# EAGLE board Tracker_v5 (EAGLE 9.6.2)
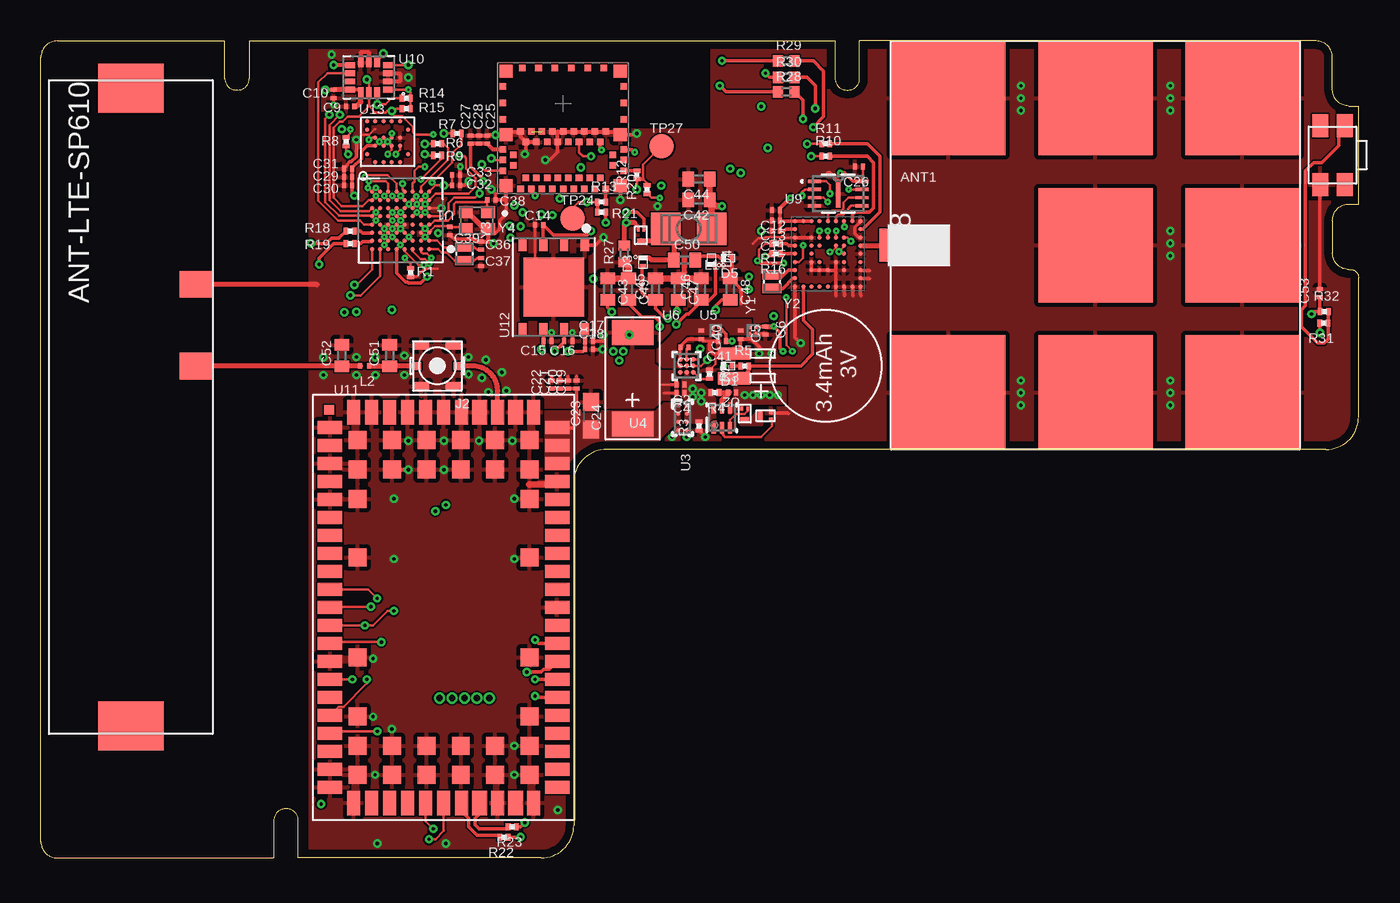
[diagram p8: board, top side]
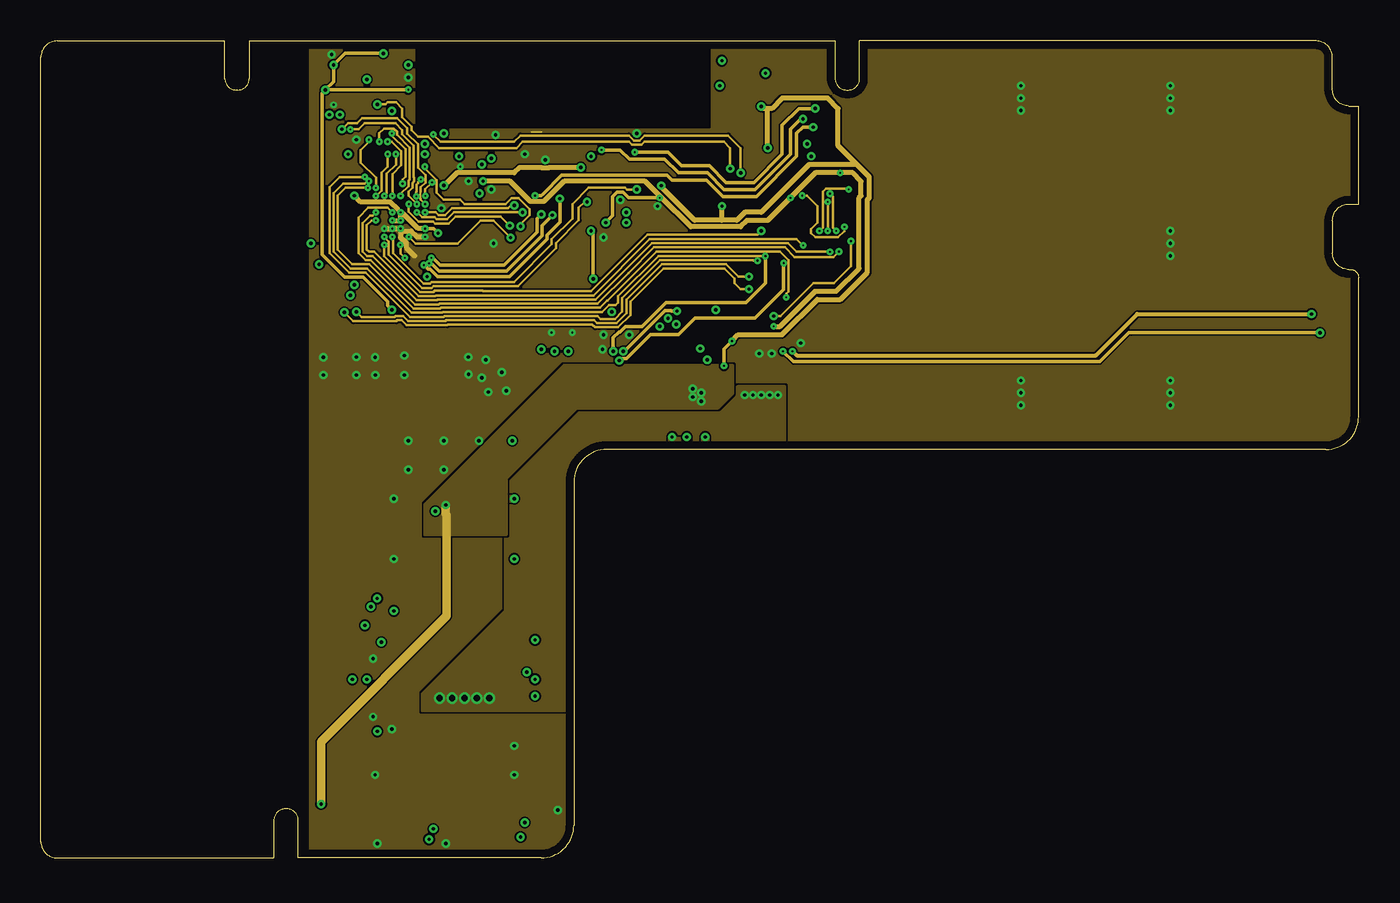
[diagram p9: board, inner layer Route2]
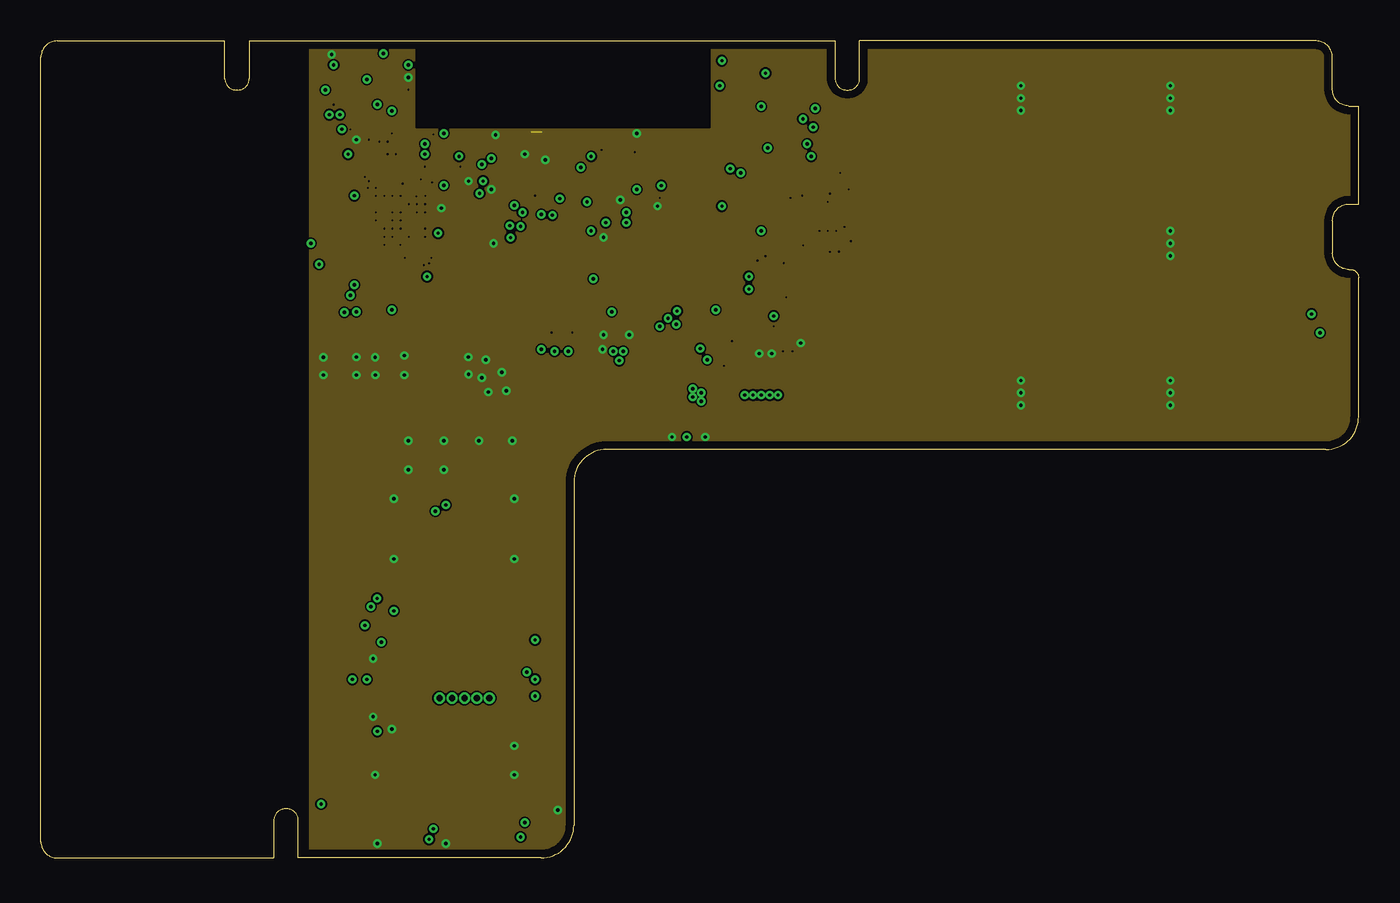
[diagram p10: board, inner layer Route15]
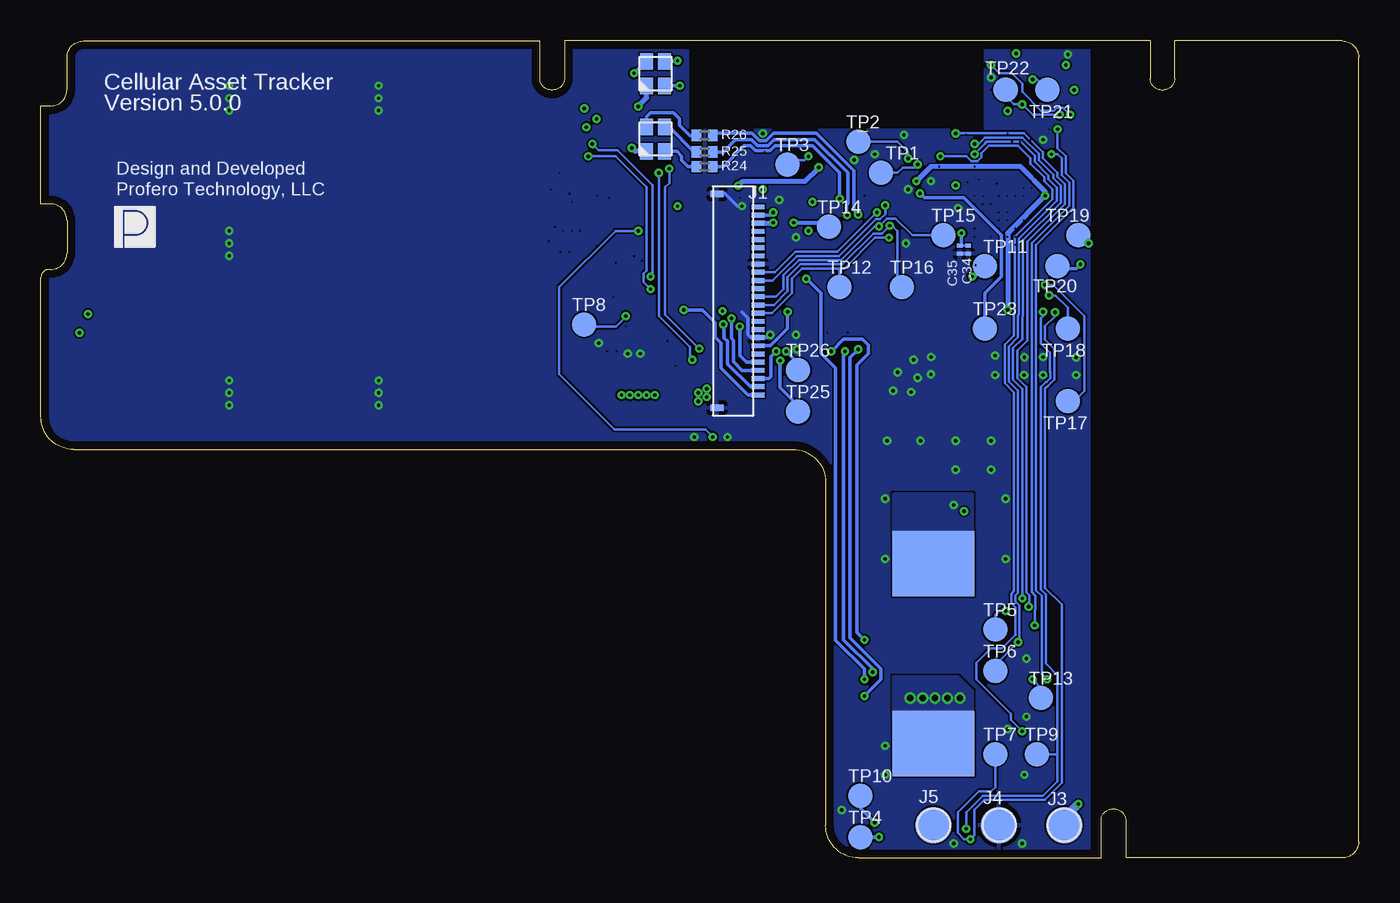
[diagram p11: board, bottom side, seen from below]

Size 80.6 x 49.98 mm. Coordinates in mm from the lower left corner, seen from the top.
Outline: 78.6,24.99 arc90 80.6,26.99 80.6,35.5 arc90 80.1,36 80,36 arc-90 79,37 79,39 arc-90 80,40 80.6,40 80.6,46 80,46 arc-90 79,47 79,48.98 arc90 78,49.98 50.08,49.98 50.08,47.68 arc-90 49.38,46.98 49.28,46.98 arc-90 48.58,47.68 48.58,49.98 12.75,49.98 12.75,47.68 arc-90 12.05,46.98 11.95,46.98 arc-90 11.25,47.68 11.25,49.98 1,49.98 arc90 0,48.98 0,1 arc90 1,0 14.25,0 14.25,2.3 arc-90 14.95,3 15.05,3 arc-90 15.75,2.3 15.75,0 30.6,0 arc90 32.6,2 32.6,22.99 arc-90 34.6,24.99 78.6,24.99
Copper layers ([2:1+2*15+16:15]): Top 0.035mm / dielectric 0.2mm / Route2 0.035mm / dielectric 0.26mm / Route15 0.035mm / dielectric 0.2mm / Bottom 0.035mm
Design rules "default *": minimum track width 3mil, minimum drill 8mil, track to track 4mil, track to pad 4mil, pad to pad 4mil, via to via 4mil, smd to smd 4mil, copper to edge 20mil, drill to drill 6mil, minimum pad ring 10mil, minimum via ring 6mil, stop-mask expansion 4mil, vias tented up to drill 16mil, thermal gap 10mil
Net classes: 1 diff: width 0.203 mm, clearance 0.127 mm
tKeepout: area 78.3,22 to 80.2,23.9; area 78.1,51.4 to 79.9,53.3

## Footprints (pad centres in the part's own frame; a part is rotated, then mirrored left to right if it is on the bottom)
SGGP.25.2.A.02 = smd 7 x 7: 1 -9,9; 2 0,9; 3 9,9; 4 -9,0; 5 0,0; 6 9,0; 7 -9,-9; 9 9,-9 | smd 2 x 2.5: 8 0,-11.95
C0201 = smd 0.25 x 0.35: 1 -0.25,0; 2 0.25,0
C0603 = smd 1.1 x 1: 1 -0.85,0; 2 0.85,0
AVX-C = smd 1.524 x 2.54: + -2.794,0; - 2.794,0
C0402 = smd 0.7 x 0.9: 1 -0.65,0; 2 0.65,0
BAT30F4 = smd 0.25 x 0.35: 1 -0.25,0; 2 0.25,0
CLMVC-FKA = smd 1 x 0.8: B1 -0.75,0.55; B2 0.75,0.55; B3 0.75,-0.55; B4 -0.75,-0.55
FH19C-24S-0.5SH = smd 0.4 x 0.8: 1 -6.55,-1.25; 2 6.55,-1.25 | smd 0.3 x 0.8: P1 -5.75,1.25; P2 -5.25,1.25; P3 -4.75,1.25; P4 -4.25,1.25; P5 -3.75,1.25; P6 -3.25,1.25; P7 -2.75,1.25; P8 -2.25,1.25; P9 -1.75,1.25; P10 -1.25,1.25; P11 -0.75,1.25; P12 -0.25,1.25; P13 0.25,1.25; P14 0.75,1.25; P15 1.25,1.25; P16 1.75,1.25; P17 2.25,1.25; P18 2.75,1.25; P19 3.25,1.25; P20 3.75,1.25; P21 4.25,1.25; P22 4.75,1.25; P23 5.25,1.25; P24 5.75,1.25
MM8430-2610 = smd 0.5 x 0.5: IN -1.25,0; OUT 1.25,0 | smd 1 x 0.5: P$1 -1,1.25; P$2 1,1.25; P$3 1,-1.25; P$4 -1,-1.25
MILL_MAX_1578 = smd 2.24 x 2.24: P$1 0,0
PAD_4MMX5MM = smd 4 x 5: P$1 0,0
L3225P = smd 1.8 x 2: 1 -1.4,0; 2 1.4,0
L0201 = smd 0.25 x 0.35: 1 -0.275,0; 2 0.275,0
3-XFDFN = smd 0.15 x 0.25: 1 0.175,-0.325; 2 -0.175,-0.325 | smd 0.5 x 0.25: 3 0,0.325
R0201 = smd 0.28 x 0.43: 1 -0.255,0; 2 0.255,0
R0402 = smd 0.6 x 0.7: 1 -0.5,0; 2 0.5,0
EVQ-7PJ/A = smd 1.4 x 1: P$1 -1.8,0.75; P$2 1.8,0.75; P$3 -1.8,-0.75; P$4 1.8,-0.75
TP15R = smd 1.5 x 1.5: TP 0,0
BGA64C50P8X8_500X500X60N = smd 0.28 x 0.28: A1 -1.75,1.75; A2 -1.25,1.75; A3 -0.75,1.75; A4 -0.25,1.75; A5 0.25,1.75; A6 0.75,1.75; A7 1.25,1.75; A8 1.75,1.75; B1 -1.75,1.25; B2 -1.25,1.25; B3 -0.75,1.25; B4 -0.25,1.25; B5 0.25,1.25; B6 0.75,1.25; B7 1.25,1.25; B8 1.75,1.25; C1 -1.75,0.75; C2 -1.25,0.75; C3 -0.75,0.75; C4 -0.25,0.75; C5 0.25,0.75; C6 0.75,0.75; C7 1.25,0.75; C8 1.75,0.75; D1 -1.75,0.25; D2 -1.25,0.25; D3 -0.75,0.25; D4 -0.25,0.25; D5 0.25,0.25; D6 0.75,0.25; D7 1.25,0.25; D8 1.75,0.25; E1 -1.75,-0.25; E2 -1.25,-0.25; E3 -0.75,-0.25; E4 -0.25,-0.25; E5 0.25,-0.25; E6 0.75,-0.25; E7 1.25,-0.25; E8 1.75,-0.25; F1 -1.75,-0.75; F2 -1.25,-0.75; F3 -0.75,-0.75; F4 -0.25,-0.75; F5 0.25,-0.75; F6 0.75,-0.75; F7 1.25,-0.75; F8 1.75,-0.75; G1 -1.75,-1.25; G2 -1.25,-1.25; G3 -0.75,-1.25; G4 -0.25,-1.25; G5 0.25,-1.25; G6 0.75,-1.25; G7 1.25,-1.25; G8 1.75,-1.25; H1 -1.75,-1.75; H2 -1.25,-1.75; H3 -0.75,-1.75; H4 -0.25,-1.75; H5 0.25,-1.75; H6 0.75,-1.75; H7 1.25,-1.75; H8 1.75,-1.75
21-100221A_W91G1+3 = smd 0.305 x 0.305: A1 -0.4,0.4; A2 0,0.4; A3 0.4,0.4; B1 -0.4,0; B2 0,0; B3 0.4,0; C1 -0.4,-0.4; C2 0,-0.4; C3 0.4,-0.4
DSE0006A = smd 0.66 x 0.25: 1 -0.62,0.5 | smd 0.7 x 0.25: 2 -0.6,0; 3 -0.6,-0.5; 4 0.6,-0.5; 5 0.6,0; 6 0.6,0.5
YZP0008ADCD = smd 0.23 x 0.23: A1 -0.25,0.75; A2 0.25,0.75; B1 -0.25,0.25; B2 0.25,0.25; C1 -0.25,-0.25; C2 0.25,-0.25; D1 -0.25,-0.75; D2 0.25,-0.75
WCSP4F = smd 0.203 x 0.203: A1 -0.175,0.175; A2 0.175,0.175; B1 -0.175,-0.175; B2 0.175,-0.175
ISP1507-AL = smd 0.8 x 0.8: 1 0.5,-0.5; 7 0.5,-3.6; 25 7.5,-3.6; 31 7.5,-0.5; 52 0.5,-7.5; 59 7.5,-7.5 | smd 0.4 x 0.4: 2 0.3,-1.4; 3 0.95,-1.725; 4 0.3,-2.05; 5 0.95,-2.375; 6 0.3,-2.7; 8 1.4,-3.8; 9 1.725,-3.15; 10 2.05,-3.8; 11 2.375,-3.15; 12 2.7,-3.8; 13 3.025,-3.15; 14 3.35,-3.8; 15 3.675,-3.15; 16 4,-3.8; 17 4.325,-3.15; 18 4.65,-3.8; 19 4.975,-3.15; 20 5.3,-3.8; 21 5.625,-3.15; 22 5.95,-3.8; 23 6.275,-3.15; 24 6.6,-3.8; 26 7.7,-2.7; 27 7.05,-2.375; 28 7.7,-2.05; 29 7.05,-1.725; 30 7.7,-1.4; 32 6.6,-0.3; 33 6.275,-0.95; 34 5.95,-0.3; 35 5.625,-0.95; 36 5.3,-0.3; 37 4.975,-0.95; 38 4.65,-0.3; 39 4.325,-0.95; 40 4,-0.3; 41 3.675,-0.95; 42 3.35,-0.3; 43 3.025,-0.95; 44 2.7,-0.3; 45 2.375,-0.95; 46 2.05,-0.3; 47 1.725,-0.95; 48 1.4,-0.3; 49 0.3,-4.55; 50 0.3,-5.55; 51 0.3,-6.55; 53 1.5,-7.7; 54 2.5,-7.7; 55 3.5,-7.7; 56 4.5,-7.7; 57 5.5,-7.7; 58 6.5,-7.7; 60 7.7,-6.55; 61 7.7,-5.55; 62 7.7,-4.55
ZOE-M8 = smd 0.27 x 0.27: P$2E1 -2,0; P$A1 -2,2; P$A2 -1.5,2; P$A3 -1,2; P$A4 -0.5,2; P$A5 0,2; P$A6 0.5,2; P$A7 1,2; P$A8 1.5,2; P$A9 2,2; P$B1 -2,1.5; P$B9 2,1.5; P$C1 -2,1; P$C3 -1,1; P$C4 -0.5,1; P$C5 0,1; P$C6 0.5,1; P$C7 1,1; P$C9 2,1; P$D1 -2,0.5; P$D3 -1,0.5; P$D4 -0.5,0.5; P$D6 0.5,0.5; P$D9 2,0.5; P$E3 -1,0; P$E7 1,0; P$E9 2,0; P$F1 -2,-0.5; P$F3 -1,-0.5; P$F4 -0.5,-0.5; P$F6 0.5,-0.5; P$F7 1,-0.5; P$F9 2,-0.5; P$G1 -2,-1; P$G3 -1,-1; P$G4 -0.5,-1; P$G5 0,-1; P$G6 0.5,-1; P$G7 1,-1; P$G9 2,-1; P$H1 -2,-1.5; P$H9 2,-1.5; P$J1 -2,-2; P$J2 -1.5,-2; P$J3 -1,-2; P$J4 -0.5,-2; P$J5 0,-2; P$J6 0.5,-2; P$J7 1,-2; P$J8 1.5,-2; P$J9 2,-2
USON-8L-2X3X0P6_MAC = smd 0.813 x 0.203: 1 -1.448,0.75; 2 -1.448,0.25; 3 -1.448,-0.25; 4 -1.448,-0.75; 5 1.448,-0.75; 6 1.448,-0.25; 7 1.448,0.25; 8 1.448,0.75 | smd 0.305 x 1.702: 9 0,0
PQFN50P300X250X86-14N = smd 0.6 x 0.35: 1 -1.16,0.75; 2 -1.16,0.25; 3 -1.16,-0.25; 4 -1.16,-0.75; 8 1.16,-0.75; 9 1.16,-0.25; 10 1.16,0.25; 11 1.16,0.75 | smd 0.35 x 0.6: 5 -0.5,-0.91; 6 0,-0.91; 7 0.5,-0.91; 12 0.5,0.91; 13 0,0.91; 14 -0.5,0.91
SARA-R4 = smd 1.5 x 0.8: 1 1.05,-2; 2 1.05,-3.1; 3 1.05,-4.2; 4 1.05,-5.3; 5 1.05,-6.4; 6 1.05,-7.5; 7 1.05,-8.6; 8 1.05,-9.7; 9 1.05,-10.8; 10 1.05,-11.9; 11 1.05,-13; 12 1.05,-14.1; 13 1.05,-15.2; 14 1.05,-16.3; 15 1.05,-17.4; 16 1.05,-18.5; 17 1.05,-19.6; 18 1.05,-20.7; 19 1.05,-21.8; 20 1.05,-22.9; 21 1.05,-24; 33 14.95,-24; 34 14.95,-22.9; 35 14.95,-21.8; 36 14.95,-20.7; 37 14.95,-19.6; 38 14.95,-18.5; 39 14.95,-17.4; 40 14.95,-16.3; 41 14.95,-15.2; 42 14.95,-14.1; 43 14.95,-13; 44 14.95,-11.9; 45 14.95,-10.8; 46 14.95,-9.7; 47 14.95,-8.6; 48 14.95,-7.5; 49 14.95,-6.4; 50 14.95,-5.3; 51 14.95,-4.2; 52 14.95,-3.1; 53 14.95,-2 | smd 0.8 x 1.5: 22 2.5,-24.95; 23 3.6,-24.95; 24 4.7,-24.95; 25 5.8,-24.95; 26 6.9,-24.95; 27 8,-24.95; 28 9.1,-24.95; 30 11.3,-24.95; 32 13.5,-24.95; 54 13.5,-1.05; 56 11.3,-1.05; 58 9.1,-1.05; 59 8,-1.05; 60 6.9,-1.05; 61 5.8,-1.05; 62 4.7,-1.05; 63 3.6,-1.05; 64 2.5,-1.05 | smd 0.9 x 1.5: 29 10.2,-24.95; 31 12.4,-24.95; 55 12.4,-1.05; 57 10.2,-1.05 | smd 1.1 x 1.1: 65 2.75,-2.75; 66 4.85,-2.75; 67 6.95,-2.75; 68 9.05,-2.75; 69 11.15,-2.75; 70 13.25,-2.75; 71 2.75,-4.55; 72 4.85,-4.55; 73 6.95,-4.55; 74 9.05,-4.55; 75 11.15,-4.55; 76 13.25,-4.55; 77 2.75,-6.35; 78 13.25,-6.35; 79 2.75,-9.95; 80 13.25,-9.95; 81 2.75,-16.05; 82 13.25,-16.05; 83 2.75,-19.65; 84 13.25,-19.65; 85 2.75,-21.45; 86 4.85,-21.45; 87 6.95,-21.45; 88 9.05,-21.45; 89 11.15,-21.45; 90 13.25,-21.45; 91 2.75,-23.25; 92 4.85,-23.25; 93 6.95,-23.25; 94 9.05,-23.25; 95 11.15,-23.25; 96 13.25,-23.25 | smd 0.6 x 0.6: P$1 1,-0.9
PSON127P500X600X82-9N = smd 0.71 x 0.51: 1 -2.55,1.905; 2 -2.55,0.635; 3 -2.55,-0.635; 4 -2.55,-1.905; 5 2.55,-1.905; 6 2.55,-0.635; 7 2.55,0.635; 8 2.55,1.905 | smd 3.6 x 3.7: 9 0,0
21-WLCSP = smd 0.275 x 0.275: A2 -0.75,1.25; A5 0.75,1.25; A6 1.25,1.25; B1 -1.25,0.75; B3 -0.25,0.75; B4 0.25,0.75; B6 1.25,0.75; C1 -1.25,0.25; C3 -0.25,0.25; C4 0.25,0.25; C6 1.25,0.25; D1 -1.25,-0.25; D3 -0.25,-0.25; D4 0.25,-0.25; D6 1.25,-0.25; E1 -1.25,-0.75; E3 -0.25,-0.75; E4 0.25,-0.75; E6 1.25,-0.75; F2 -0.75,-1.25; F5 0.75,-1.25
ANT-LTE-SP610-T = smd 1.65 x 2: 1 2.5,-4; 2 7.5,-4 | smd 3 x 4: 3 -19.5,0; 4 19.5,0
ECS-.327-12.5-1210-TR = smd 0.575 x 1.14: 1 -0.412,0; 2 0.412,0
ML614-TZ21 = smd 0.75 x 2: 1 0.75,1; 2 -0.75,1
XTAL_ECS-160-9-37-CKM-TR = smd 0.85 x 0.75: 1 -0.675,-0.525; 2 0.675,-0.525; 3 0.675,0.525; 4 -0.675,0.525

## Placement (x,y rotation side)
ANT1  SGGP.25.2.A.02  [SGGP.25.2.A.02]  64.5,37.48 270 top
C1  0.47uF  [C0201]  39.37,31.24 180 top
C2  0.1uF  [C0201]  39.12,28.96 180 top
C3  0.1uF  [C0201]  42.27,28.47 0 top
C4  1uF  [C0201]  39.12,28.45 180 top
C5  1uF  [C0201]  42.8,32 270 top
C6  1uF  [C0201]  44.32,32.26 270 top
C9  0.1uF  [C0201]  18.92,45.97 180 top
C10  0.1uF  [C0201]  17.91,46.74 270 top
C11  0.1uF  [C0201]  44.96,38.35 180 top
C12  1uF  [C0201]  44.96,39.62 180 top
C13  0.01uF  [C0201]  44.96,38.99 180 top
C14  47pF  [C0201]  30.48,38.73 180 top
C15  47pF  [C0201]  30.99,31.62 0 top
C16  47pF  [C0201]  32.26,31.62 0 top
C17  0.1uF  [C0201]  33.53,31.62 0 top
C18  47pF  [C0201]  33.53,31.11 0 top
C19  15pF  [C0201]  32.77,28.96 90 top
C20  68pF  [C0201]  32.26,28.96 90 top
C21  10000pF  [C0201]  31.75,28.96 90 top
C22  0.1uF  [C0201]  31.24,28.96 90 top
C23  10uF  [C0603]  33.66,27.05 90 top
C24  F931C107MCC  [AVX-C]  36.2,29.34 90 top
C25  0.1uF  [C0201]  27.3,43.94 90 top
C26  0.1uF  [C0201]  50.04,42.29 180 top
C27  0.1uF  [C0201]  26.29,43.94 90 top
C28  1uF  [C0201]  26.8,43.94 90 top
C29  10000pF  [C0201]  18.8,41.66 180 top
C30  10000pF  [C0201]  18.8,41.15 180 top
C31  10000pF  [C0201]  18.8,42.16 180 top
C32  0.1uF  [C0201]  25.4,41.15 0 top
C33  10000pF  [C0201]  25.4,41.78 0 top
C34  0.1uF  [C0201]  23.88,37.21 270 bottom
C35  10000pF  [C0201]  24.38,37.21 270 bottom
C36  [C0201]  26.92,37.47 90 top
C37  [C0201]  26.92,36.45 270 top
C38  [C0201]  27.56,40.26 0 top
C39  [C0201]  25.02,38.35 270 top
C40  1uF  [C0201]  40.39,32 270 top
C41  1uF  [C0201]  41.66,31.62 180 top
C42  1uF  [C0402]  40.26,40.26 180 top
C43  1uF  [C0402]  34.67,34.8 270 top
C44  0.1uF  [C0402]  40.26,41.53 180 top
C45  1uF  [C0402]  37.59,34.8 90 top
C46  1uF  [C0402]  40.39,34.8 90 top
C47  1uF  [C0402]  38.99,34.8 270 top
C48  1uF  [C0402]  42.16,34.8 270 top
C49  1uF  [C0402]  35.94,34.8 270 top
C50  4.7uF  [C0402]  39.37,36.58 0 top
C51  [C0402]  21.34,30.73 90 top
C52  [C0402]  18.41,30.73 90 top
C53  100pF  [C0201]  78.22,34.55 90 top
D1  BAT30F4  [BAT30F4]  42.04,30.1 180 top
D2  CLMVC-FKA  [CLMVC-FKA]  43,43.98 90 bottom
D3  BAT30F4  [BAT30F4]  36.83,36.45 90 top
D4  BAT30F4  [BAT30F4]  41.02,36.58 270 top
D5  BAT30F4  [BAT30F4]  42.04,36.7 180 top
D6  CLMVC-FKA  [CLMVC-FKA]  43,47.98 90 bottom
J1  E2154CS091  [FH19C-24S-0.5SH]  38,34.08 270 bottom
J2  MM8430-2610  [MM8430-2610]  24.26,30.1 180 top
J3  1578-X-57-15-00-00-03-0  [MILL_MAX_1578]  18,2 270 bottom
J4  1578-X-57-15-00-00-03-0  [MILL_MAX_1578]  22,2 270 bottom
J5  1578-X-57-15-00-00-03-0  [MILL_MAX_1578]  26,2 270 bottom
J6  SMD_PADPAD_4MMX5MM  [PAD_4MMX5MM]  26,18 270 bottom
J7  SMD_PADPAD_4MMX5MM  [PAD_4MMX5MM]  26,7 270 bottom
L1  CBC3225T100KR  [L3225P]  39.62,38.48 180 top
L2  [L0201]  19.81,30.1 180 top
Q1  CSD13381F412VN  [3-XFDFN]  43.05,27.18 180 top
Q2  CSD13381F412VN  [3-XFDFN]  44.32,27.05 90 top
Q3  CSD13381F412VN  [3-XFDFN]  36.7,38.1 180 top
R1  100k  [R0201]  22.61,35.81 270 top
R2  10k  [R0201]  40.89,29.59 270 top
R3  2k  [R0201]  40.26,26.42 90 top
R4  330  [R0201]  41.22,28.47 180 top
R5  1k  [R0201]  43.05,30.1 0 top
R6  100  [R0201]  24.26,43.69 180 top
R7  100  [R0201]  25.46,44.32 180 top
R8  100  [R0201]  18.67,43.81 270 top
R9  100  [R0201]  24.26,42.98 180 top
R10  dnp  [R0201]  48.01,42.93 0 top
R11  dnp  [R0201]  48.01,43.69 0 top
R12  100  [R0201]  36.45,41.78 90 top
R13  100  [R0201]  34.29,40.13 0 top
R14  4.7k  [R0201]  22.35,46.48 180 top
R15  4.7k  [R0201]  22.35,45.85 180 top
R16  100  [R0201]  44.96,36.96 180 top
R17  100  [R0201]  44.96,37.59 180 top
R18  29  [R0201]  18.92,38.35 0 top
R19  29  [R0201]  18.92,37.59 0 top
R20  dnp  [R0201]  37.08,40.89 90 top
R21  dnp  [R0201]  34.29,39.5 180 top
R22  29  [R0201]  28.32,1.27 180 top
R23  29  [R0201]  28.83,1.91 180 top
R24  130  [R0402]  40.01,42.29 0 bottom
R25  30  [R0402]  40.01,43.18 0 bottom
R26  30  [R0402]  40.01,44.2 0 bottom
R27  0.470  [R0402]  35.69,36.96 90 top
R28  130  [R0402]  45.59,46.86 0 top
R29  30  [R0402]  45.59,48.77 0 top
R30  30  [R0402]  45.59,47.75 0 top
R31  100k  [R0201]  78.48,32.72 180 top
R32  100k  [R0201]  78.49,33.43 0 top
S1  EVQ-7PJ  [EVQ-7PJ/A]  79,43 90 top
TP1  TPTP15R  [TP15R]  29.21,41.91 0 bottom
TP2  TPTP15R  [TP15R]  30.61,43.81 0 bottom
TP3  TPTP15R  [TP15R]  34.92,42.42 0 bottom
TP4  TPTP15R  [TP15R]  30.48,1.27 0 bottom
TP5  TPTP15R  [TP15R]  22.23,13.97 0 bottom
TP6  TPTP15R  [TP15R]  22.23,11.43 0 bottom
TP7  TPTP15R  [TP15R]  22.23,6.35 0 bottom
TP8  TPTP15R  [TP15R]  47.37,32.64 0 bottom
TP9  TPTP15R  [TP15R]  19.68,6.35 0 bottom
TP10  TPTP15R  [TP15R]  30.48,3.81 0 bottom
TP11  TPTP15R  [TP15R]  22.86,36.2 0 bottom
TP12  TPTP15R  [TP15R]  31.75,34.92 0 bottom
TP13  TPTP15R  [TP15R]  19.43,9.78 0 bottom
TP14  TPTP15R  [TP15R]  32.38,38.61 0 bottom
TP15  TPTP15R  [TP15R]  25.4,38.1 0 bottom
TP16  TPTP15R  [TP15R]  27.94,34.92 0 bottom
TP17  TPTP15R  [TP15R]  17.78,27.94 0 bottom
TP18  TPTP15R  [TP15R]  17.78,32.38 0 bottom
TP19  TPTP15R  [TP15R]  17.14,38.1 0 bottom
TP20  TPTP15R  [TP15R]  18.41,36.2 0 bottom
TP21  TPTP15R  [TP15R]  19.05,46.99 0 bottom
TP22  TPTP15R  [TP15R]  21.59,46.99 0 bottom
TP23  TPTP15R  [TP15R]  22.86,32.38 0 bottom
TP24  TPTP15R  [TP15R]  32.51,39.13 0 top
TP25  TPTP15R  [TP15R]  34.29,27.3 0 bottom
TP26  TPTP15R  [TP15R]  34.29,29.84 0 bottom
TP27  TPTP15R  [TP15R]  37.97,43.53 0 top
U1  STM32L412RBI6  [BGA64C50P8X8_500X500X60N]  22,39 180 top
U2  MAX17262REWL+T  [21-100221A_W91G1+3]  39.5,30.1 180 top
U3  BQ29700DSER  [DSE0006A]  41.66,26.92 90 top
U4  TPS22970YZPR  [YZP0008ADCD]  39.24,26.92 0 top
U5  TCR3UG18A  [WCSP4F]  43.56,32.26 0 top
U6  TCR3UG33A  [WCSP4F]  41.27,32.26 0 top
U7  ISP1507ALISP1507AL_ISP1507-AL  [ISP1507-AL]  35.94,40.64 180 top
U8  ZOE-M8B  [ZOE-M8]  48.13,36.96 270 top
U9  MX25R1635FZUIL0  [USON-8L-2X3X0P6_MAC]  48.77,40.64 0 top
U10  LSM6DSMTR  [PQFN50P300X250X86-14N]  20.07,47.75 180 top
U11  SARA-R4  [SARA-R4]  16.64,28.32 0 top
U12  SIM-ST-MFF2  [PSON127P500X600X82-9N]  31.37,34.92 270 top
U13  AT25QL128A-UUE-T  [21-WLCSP]  21.21,43.81 90 top
U$1  ANT-LTE-SP610-T  [ANT-LTE-SP610-T]  5.5,27.59 90 top
U$2  [PROFERO-LOGO-SMALL]  76.12,37.34 0 bottom
Y1  ECS-.327-12.5-1210-TR  [ECS-.327-12.5-1210-TR]  44.72,35.25 90 top
Y2  ML614-TZ21  [ML614-TZ21]  41.4,30.1 270 top
Y3  ECS-.327-12.5-1210-TR  [ECS-.327-12.5-1210-TR]  25.91,36.96 270 top
Y4  ECS-160-9-37-CKM-TR  [XTAL_ECS-160-9-37-CKM-TR]  26.67,38.99 180 top

## Tracks (layer width: path | path; a pad name or v marks a point on that pad's centre or on a via)
!EINK_BUSY  (via drill 0.1 pad 0.2 layers 1-2, 0.2)
  Top 0.152: U1.E3 v23,39.5
  Route2 0.152: v23,39.5 23.3,39.2 24.09,39.2 24.22,39.06 24.84,39.06 25.27,39.5 v29.46,39.5
  Bottom 0.152: J1.P9 35.71,35.83 34.46,37.08 31.88,37.08 v29.46,39.5
!EINK_RESET  (via drill 0.1 pad 0.2 layers 1-2, 0.2)
  Top 0.152: U1.E2 v23.5,39.5
  Route2 0.152: v23.5,39.5 24.14,39.5 24.32,39.32 24.71,39.32 25.15,39.75 28.57,39.75 28.75,39.93 v28.96,39.93
  Bottom 0.152: J1.P10 35.85,35.33 34.35,36.83 31.77,36.83 29.54,39.06 29.29,39.06 28.96,39.39 v28.96,39.93
!GPS_RESET  (via drill 0.1 layers 1-2)
  Top 0.152: U1.E7 v20.5,39 | v46.62,37.47 46.62,36.84 46.61,36.83 46.61,36.7 46.36,36.46 U8.P$J6
  Route2 0.152: v20.5,39 20.22,39 19.94,38.72 19.94,37.21 20.07,37.08 20.38,37.08 23.1,34.37 24.12,34.37 24.17,34.42 33.79,34.42 37.24,37.87 46.22,37.87 v46.62,37.47
!SARA_RESET  (via drill 0.2)
  Top 0.152: U1.G1 24.14,40.64 26.16,40.64 26.59,41.07 26.59,41.59 26.01,42.17 26.01,42.82 25.91,42.93 v25.58,42.93 | v20.57,7.75 17.81,7.75 U11.18
  Bottom 0.152: v25.58,42.93 23.98,42.93 23.67,42.62 23.32,42.62 23.06,42.87 23.06,43.1 22.61,43.56 20.83,43.56 20.07,42.8 20.07,42.48 19.23,41.65 19.23,41.41 18.72,40.9 18.72,40.31 21.03,38 21.03,33.35 21.08,33.3 21.08,31.96 21.65,31.39 21.65,29.05 21.08,28.48 21.08,16.33 21.25,16.16 21.25,15.59 21,15.34 21,13.65 21.82,12.83 22.48,12.83 23.37,11.94 23.37,10.92 21.26,8.81 21.26,8.43 v20.57,7.75
!ST_RESET  (via drill 0.2 pad 0.2)
  Top 0.152: U1.E1 24.61,39.25 24.93,39.57 24.93,40.05 25.27,40.39 26.57,40.39 v26.83,40.65
  Bottom 0.203: v26.83,40.65 26.57,40.39 24.13,40.39 21.84,38.1 21.84,35.56 22.86,34.54 TP23.TP
+1.8V  (via drill 0.1 layers 1-2, 0.1 pad 0.2 layers 1-2, 0.2, 0.2 pad 0.2)
  Top 0.152: U1.E6 v21.5,39 | U1.E5 v22,39 | U1.E4 v22,39.5 | v23.5,38.5 U1.D2 | U9.8 50.22,41.71 50.29,41.78 C26.1 | R15.1 R14.1 22.61,46.86 v22.47,47 U10.1 | R20.1 37.34,40.39 v37.85,40.39
  Top 0.203: U8.P$J2 45.57,38.46 45.47,38.35 C11.1 C13.1 | C13.1 45.24,38.96 U8.P$J1 U8.P$H1 | C12.1 C13.1 | U8.P$G1 U8.P$H1 | U8.P$H1 46.61,38.98 | U5.A2 43.81,32.51 C6.1 | C10.1 v17.4,46.99 | U10.11 19.41,47 U10.12 19.42,46.99 18.89,46.99 | v19.18,40.51 19.05,40.64 C30.1 C29.1 C31.1 19.05,42.23 19.61,42.79 19.61,43.23 19.94,43.56 U13.B3 | R21.1 v34.55,38.86 v34.54,38.86 | v27.05,41.4 27.05,41.53 26.29,42.29 C27.1 | U9.8 49.67,41.39 49.15,41.91 v48.9,41.91 | v44.83,32.51 45.21,32.13 45.21,31.17 v45.39,30.99 | R31.2 v78.22,32.14 v78.23,32.13
  Top 0.254: U10.8 v17.92,48.5 v17.91,48.51 | U10.5 20.57,48.83 v20.95,49.22 | U7.26 27.66,43.34 C25.1 C28.1 C27.1 | C12.1 45.21,39.75 v45.84,40.39 v45.85,40.39
  Top 0.305: U10.11 18.89,46.99 C10.1 | U10.12 19.57,46.24 19.3,45.97 C9.1 | C6.1 v44.83,32.51
  Route2 0.203: v21.46,33.53 21.21,33.78 21.21,34.04 19.71,35.53 18.57,35.53 17.2,36.91 17.2,46.79 v17.4,46.99 | v17.4,46.99 17.91,47.5 v17.91,48.51 18.61,49.22 v20.95,49.22 | v22.47,47 17.41,47 v17.4,46.99 | v34.54,38.86 34.98,39.29 34.98,40.45 35.24,40.72 35.62,40.72 35.95,40.39 v37.85,40.39 37.97,40.39 | v45.39,30.99 46.02,30.35 64.77,30.35 66.55,32.13 v78.23,32.13 | v24.29,38.23 24.02,38.5 v23.5,38.5
  Route2 0.305: v22,39.5 v22,39 v21.5,39 | v22,39.5 21.86,39.64 21.86,39.65 21.37,40.13 19.56,40.13 v19.18,40.51 | v23.5,38.5 23.08,38.5 22.08,39.5 v22,39.5 | v27.05,41.4 28.7,41.4 29.95,40.16 30.75,40.16 30.86,40.26 32,41.4 36.96,41.4 37.97,40.39 39.75,38.61 42.8,38.61 43.18,38.99 44.45,38.99 v45.85,40.39 47.37,41.91 v48.9,41.91 49.66,41.91 50.16,41.4 50.16,40.51 50.04,40.39 50.04,36.07 48.64,34.67 47.37,34.67 45.21,32.51 v44.83,32.51
  Bottom 0.152: C35.1 C34.1
  Bottom 0.203: C35.1 24.29,37.55 v24.29,38.23
  Bottom 0.254: v34.54,38.86 32.64,38.86 TP14.TP
  Bottom 0.305: v27.05,41.4 26.16,42.29 20.7,42.29 19.18,40.77 v19.18,40.51 21.46,38.23 v21.46,33.53
+3.3V  (via drill 0.1 layers 1-2, 0.2)
  Top 0.152: U1.H1 24.15,41.15 v24.64,41.15 C32.1 C33.1
  Top 0.203: U6.A2 41.53,32.43 41.91,32.06 C41.1
  Top 0.305: C41.1 v42.27,31.62
  Top 0.406: C44.1 C42.1 | C42.1 41.02,40.14 L1.1 | C42.1 41.29,39.88 v41.66,39.88
  Route2 0.203: D1.2 41.79,31.14 v42.27,31.62
  Route2 0.305: v42.27,31.62 42.65,32 45.34,32 47.5,34.16 48.9,34.16 50.55,35.81 50.55,40.26 50.67,40.39 50.67,41.66 49.91,42.42 | 49.91,42.42 48.77,43.56 48.77,45.85 48.13,46.48 45.34,46.48 44.7,45.85 44.45,45.85 | 49.91,42.42 46.99,42.42 44.07,39.5 43.05,39.5 42.57,39.01 41.66,39.01 | v37.95,41.13 37.95,41.04 39.98,39.01 41.66,39.01 | v24.64,41.15 24.68,41.15 25.44,41.91 28.96,41.91 29.29,42.24 30.61,42.24 30.65,42.2 31.07,42.2 31.11,42.24 v33.02,42.24 | 44.45,45.85 44.2,45.85 v44.07,45.97 | v44.45,43.43 44.45,45.85 | 41.66,39.01 v41.66,39.88
  Bottom 0.305: v37.95,41.13 37.67,41.4 33.86,41.4 v33.02,42.24 | D2.B1 44.25,43.23 v44.45,43.43 | v44.07,45.97 43.55,46.49 D6.B1
  other vias: 41.79,30.1
+CELL_POWER
  Top 0.203: C22.1 C21.1 C20.1 C19.1 32.77,26.54 32.51,26.29 31.62,26.29 U11.53
  pour Top (no thermals): 30.86,23.75 30.86,27.3 37.59,27.3 38.1,27.81 39.06,27.81 39.06,26.62 38.81,26.62 35.94,23.75
+SYS_PWR
  pour Top (no thermals): 39.17,30.18 39.17,30.02 38.05,30.02 37.72,30.35 37.72,31.11 39.5,32.89 43.41,32.89 43.41,32.04 39.53,32.04 38.99,31.5 38.99,30.18
BATT-  (via drill 0.2, 0.38)
  other vias: 24.38,9.78 25.15,9.78 25.91,9.78 26.67,9.78 27.43,9.78 43.05,28.32 43.56,28.32 44.07,28.32 44.58,28.32 45.09,28.32
  pour Route2 (rank 2): 23.37,9.02 23.37,10.03 28.45,15.11 28.45,23.24 32.77,27.56 41.4,27.56 42.67,28.83 45.47,28.83 45.47,24.89 45.21,24.64 34.54,24.64 33.02,23.11 33.02,9.02
  pour Bottom (no thermals): 23.62,8.89 23.62,10.16 24.51,11.05 28.32,11.05 28.45,11.05 28.45,8.89
  pour Top (no thermals): 42.11,27.2 42.91,27.2 42.91,27.81 45.54,27.81 45.54,28.78 42.42,28.78 42.42,28.22 42.11,27.91
CELL_LOAD_EN  (via drill 0.1 pad 0.2 layers 1-2, 0.2)
  Top 0.152: v21,37.5 U1.B6 | U4.D2 v39.5,25.75
  Route2 0.152: v21,37.5 21,36.83 23.2,34.62 24.01,34.62 24.09,34.7 27.03,34.7 27.05,34.67 33.66,34.67 37.1,38.12 43.84,38.12 v44.07,38.35
  Bottom 0.152: v44.07,38.35 45.47,38.35 48.9,34.92 48.9,29.59 45.51,26.21 39.95,26.21 v39.5,25.75
EINK_CS  (via drill 0.1 pad 0.2 layers 1-2, 0.2)
  Top 0.152: U1.H3 22.75,41.27 22.86,41.38 22.86,42.04 23.11,42.29 v23.5,42.29
  Route2 0.152: v29.34,38.63 29.34,38.76 29.9,39.32 29.9,39.68 29.21,40.36 28.78,40.36 28.42,40.01 25.91,40.01 25.65,40.26 24.64,40.26 24.2,40.69 24.2,41.46 23.5,42.17 v23.5,42.29
  Bottom 0.152: J1.P12 35.65,34.33 35.18,34.8 35.18,35.64 34.25,36.58 31.67,36.58 29.61,38.63 v29.34,38.63 28.85,39.12 28.32,39.12 27.3,38.1 TP15.TP
EINK_MOSI  (via drill 0.1 pad 0.2 layers 1-2, 0.2)
  Top 0.152: U1.C4 v22.5,38
  Route2 0.152: v22.5,38 22.91,37.59 25.48,37.59 26.88,38.99 27.69,38.99 v28.73,37.95
  Bottom 0.152: J1.P14 35.88,33.33 34.67,34.54 34.67,35.43 34.04,36.07 31.88,36.07 | v28.73,37.95 29.58,37.95 31.46,36.07 31.88,36.07 | TP12.TP 31.75,35.94 31.88,36.07
EINK_SCK  (via drill 0.1 pad 0.2 layers 1-2, 0.2)
  Top 0.152: U1.F4 v22.5,40
  Route2 0.152: v22.5,40 22.5,39.55 23.1,38.94 23.98,38.94 24.11,38.81 24.95,38.81 25.38,39.24 28.12,39.24 v28.67,38.68
  Bottom 0.152: J1.P13 35.77,33.83 34.92,34.67 34.92,35.54 34.14,36.32 31.56,36.32 29.68,38.2 29.16,38.2 v28.68,38.68 v28.67,38.68 28.6,38.76 28.19,38.35 28.19,35.18 TP16.TP
GND  (via drill 0.1 layers 1-2, 0.1 pad 0.2 layers 1-2, 0.2, 0.2 pad 0.25)
  Top 0.152: U1.D6 v21,38.5 | U1.D4 v22,38.5 | U1.D5 v21.5,38.5 | U1.C2 v23.5,38 | U1.F1 v24.5,39.75 | U2.C3 39.1,31.22 C1.2 | R2.1 41.27,30.23 41.27,30.73 41.4,30.86 42.29,30.86 42.39,30.86 Y2.2 | C38.2 27.81,40.64 v27.56,40.89 | C10.2 v17.91,46.08 | U8.P$J3 45.45,37.96 45.43,37.98 44.31,37.98 44.25,37.92 43.89,37.92 43.56,37.59 | C14.2 30.23,36.06 U12.9 | v19.3,43.94 19.61,44.25 20.09,44.25 20.42,44.58 20.45,44.58 | R1.2 22.99,35.56 23.42,35.99 23.54,35.99 23.61,36.07 24.26,36.07 | C2.2 37.97,28.96 | C4.2 38.1,28.45
  Top 0.203: U8.P$J3 U8.P$G3 | 48.64,34.42 48.64,34.95 U8.P$D9 48.63,35.94 | U8.P$C9 49.15,34.94 49.15,34.42 | U8.P$B9 49.66,34.93 49.66,34.42 | U8.P$A9 50.13,34.45 50.16,34.42 | U8.P$A8 50.16,35.43 50.67,35.43 | U8.P$A7 50.15,35.94 50.67,35.94 | R3.1 40.26,26.13 v40.64,25.75 | Q2.1 45.67,27.23 45.72,27.18 | U6.B2 41.45,31.67 C41.2 40.89,31.62 | U5.B2 44.25,32.08 C6.2 | 40.89,31.62 40.52,31.62 C40.2 39.55,31.75 39.12,31.33 C1.2 | C30.2 C29.2 C31.2 18.72,42.34 18.72,42.42 18.89,42.6 18.98,42.6 19.3,42.91 v19.3,43.94 | C16.2 v32.51,32.13 arc90 v32.5,32.14 | C15.2 v31.24,32.13 arc90 v31.23,32.14 | C39.2 25.26,37.86 26.56,37.86 26.71,37.72 C36.2 | U12.1 33.92,37.48 v34.42,37.97 | U7.1 35.44,40.27 v35.43,40.26 | U9.9 48.77,41.4 48.26,41.91 48.13,41.91 | v25.65,42.29 C33.2 C32.2 25.91,41.15 v26.16,41.4 | U7.23 29.67,43.13 v29.59,43.05 | U7.17 31.62,43.17 31.15,42.71 v30.86,42.71 | U7.7 36.37,44.24 v36.45,44.32 | C27.2 C28.2 C25.2 27.35,44.24 v27.81,44.24 U7.25 | C17.2 34.42,31.62 v34.42,32 | v34.35,31.11 C18.2 | C22.2 31.24,29.46 | 31.75,29.46 C21.2 | 32.26,29.46 C20.2 | C19.2 32.77,29.46 | 40.89,31.62 40.89,31.11 41.15,30.86 42.29,30.86 42.42,30.73 43.05,30.73 42.8,30.99 C5.2 43.43,31.75 43.94,31.24 v43.94,30.86 | U8.P$D6 48.63,35.94 | 48.63,35.94 48.15,35.94 U8.P$E7 U8.P$F7 U8.P$G7 U8.P$G6 | U8.P$J9 46.13,31.84 v46.48,31.5 | C53.2 78.23,34.81 78.23,41.18 S1.P$1 | U7.31 28.44,40.38 | 28.44,40.38 28.32,40.26 C38.2 | 28.44,40.38 28.44,39.36 28.07,38.99 28.07,38.48 27.81,38.23 27.34,38.23 | U8.P$A1 50.13,38.94 49.8,38.6 49.8,38.19 50.03,37.96 U8.P$A3 | D5.1 42.29,35.57 C48.1 42.82,34.8 42.82,33.91 | U4.D1 38.99,26.14 v38.61,25.75
  Top 0.254: U10.6 20.07,49.28 19.56,49.28 19.56,48.67 U10.7 | U10.3 21.97,48.01 21.97,47.5 U10.2 | C36.2 27.43,37.72 | 27.43,37.72 27.56,37.72 v27.69,37.59 | Y4.4 27.34,38.23 27.34,37.8 27.43,37.72 | U11.72 22.46,23.77 v22.48,23.75 | U7.25 28.64,44.44 U7.24 29.34,44.12 U7.23 U7.21 | U7.18 31.62,44.44 | 31.62,44.44 U7.16 U7.14 U7.12 U7.10 U7.8 35.24,44.44 U7.7 | U7.17 31.62,44.43 31.62,44.44
  Top 0.305: Y4.2 26.04,39.47 26.14,39.47 27.15,38.46 Y4.4 | C47.1 39.37,35.83 39.37,36.7
  Top 0.32: U$1.2 16.85,35.09 arc-90 16.89,35.05
  Top 0.406: C45.2 C47.1 C46.2 | R27.1 35.94,36.2 C49.1 C43.1 | U11.50 31.43,22.86 29.84,22.86
  Route2 0.305: v22,38.5 22.14,38.36 22.65,38.36 23,38 v23.5,38 | v21,38.5 v21.5,38.5 v22,38.5 | v22,38.5 22,37.95 22.1,37.86 22.14,37.86 22.34,37.65 22.34,37.35 22.86,36.83
  Bottom 0.203: C35.2 C34.2 | J1.1 38.74,40.63 37.99,39.88 v37.72,39.88 | 37.72,33.4 37.35,33.03 37.35,32.02 37.16,31.83 J1.P17 36.17,31.83 v35.99,32
  other vias: 28.47,28.58 27.37,28.5 26.96,29.38 26.16,29.58 26.15,30.65 27.22,30.47 28.2,29.71 22.23,30.73 22.23,29.55 20.45,29.54 19.29,29.55 19.3,30.64 20.45,30.62 17.27,30.63 17.27,29.54 22.48,47.75 17.78,49.15 22.48,25.53 24.64,25.53 24.64,23.75 26.8,25.53 28.96,21.97 28.96,18.29 20.32,12.19 20.32,8.64 20.45,5.08 28.96,5.08 28.96,6.86 21.46,7.87 28.83,25.53 44.7,30.86 20.57,0.89 24.77,0.89 31.62,2.92 21.59,18.29 21.59,21.97 59.94,46.48 59.94,45.72 59.94,47.24 59.94,28.45 59.94,27.69 59.94,29.21 69.09,28.45 69.09,27.69 69.09,29.21 69.09,37.59 69.09,36.83 69.09,38.35 69.09,46.48 69.09,45.72 69.09,47.24
  pour Top (rank 5): 16.5,51 82,51 82,-4 16.5,-4
  pour Route2 (rank 5): 16.5,51 84,51 84,-4 16.5,-4
  pour Route15 (rank 5): 16.5,51 86,51 86,-4 16.5,-4
  pour Bottom (rank 5): 16.5,51 88,51 88,-4 16.5,-4
  cutout Route2: 22.99,51.56 22.99,44.7 40.89,44.7 40.89,51.56
  cutout Route15: 22.99,51.18 40.89,51.18 40.89,44.7 22.99,44.7
GPS_BOOT  (via drill 0.1 layers 1-2, 0.1 pad 0.2 layers 1-2)
  Top 0.152: U1.F5 v21.5,39.5 | U8.P$C4 49.13,37.41 v48.81,37.09
  Route2 0.152: v21.5,39.5 21.22,39.78 20.03,39.78 19.43,39.18 19.43,37 19.86,36.58 20.17,36.58 22.89,33.86 24.33,33.86 24.38,33.91 34.06,33.91 35.94,35.79 37.51,37.36 45.52,37.36 46.11,36.77 48.49,36.77 v48.81,37.09
GPS_DSEL  (via drill 0.1 layers 1-2, 0.1 pad 0.2 layers 1-2)
  Top 0.152: U1.F7 v20.5,39.5 | U8.P$D4 48.63,37.33 48.39,37.08 v48.26,37.08
  Route2 0.152: v20.5,39.5 20.28,39.28 20.14,39.28 19.68,38.83 19.68,37.11 19.96,36.83 20.28,36.83 22.99,34.11 24.22,34.11 24.27,34.16 33.92,34.16 37.37,37.61 45.7,37.61 46.23,37.08 v48.26,37.08
GPS_RX  (via drill 0.1 layers 1-2, 0.2)
  Top 0.152: U1.H5 21.75,41.25 21.22,41.78 19.94,41.78 v19.81,41.66 | v43.84,36.54 43.84,36.55 43.93,36.63 43.93,37.21 44.31,37.59 R17.2
  Top 0.203: v45.44,36.39 44.01,36.39 43.84,36.55
  Route2 0.152: v19.81,41.66 18.29,41.66 17.65,41.02 17.65,37 18.84,35.81 19.86,35.81 22.57,33.1 24.64,33.1 24.69,33.15 34.06,33.15 34.24,32.97 35.1,32.97 35.56,33.42 35.56,34.26 37.88,36.58 43.54,36.58 43.58,36.54 v43.84,36.54
  Route2 0.203: v35.38,30.43 35.49,30.54 35.81,30.54 37.28,32 38.99,32 40.01,33.02 43.69,33.02 45.44,34.77 v45.44,36.39
  Bottom 0.203: TP25.TP 34.29,27.69 35.38,28.78 v35.38,30.43
GPS_SCL
  Top 0.203: U8.P$B1 49.63,39.35 49.78,39.5 50.67,39.5 50.93,39.75 50.93,42.55 50.55,42.93 R10.2
GPS_SDA
  Top 0.203: U8.P$A2 50.27,38.46 51.31,39.5 51.31,42.93 50.55,43.69 R11.2
GPS_TX  (via drill 0.1 layers 1-2, 0.2)
  Top 0.152: U1.H6 21.25,41.25 21.1,41.4 v20.07,41.4 | R16.2 44.58,36.96 44.42,36.8 44.33,36.8 v44.31,36.81
  Route2 0.152: v20.07,41.4 19.95,41.4 19.8,41.25 18.5,41.25 17.91,40.66 17.91,37.11 18.95,36.07 19.96,36.07 22.68,33.35 24.54,33.35 24.59,33.4 34.31,33.4 34.75,33.83 35.16,33.83 35.31,33.98 35.31,34.36 37.77,36.83 44.3,36.83 v44.31,36.81 | v35.01,30.99 35.03,30.99
  Route2 0.203: v35.01,30.99 35.01,31.83 35.36,32.18 35.43,32.18 35.76,32.51 36.77,32.51 38.24,33.98 43.13,33.98 43.48,34.34 43.5,34.34 44.31,35.16 v44.31,36.81
  Bottom 0.152: TP26.TP 34.29,30.27
  Bottom 0.203: 34.29,30.27 v35.01,30.99
ISP_RESET  (via drill 0.2)
  Top 0.152: U7.13 32.92,43.16 33.15,42.93 v33.66,42.93
  Bottom 0.152: v33.66,42.93 33.91,42.67 34.67,42.67 TP3.TP
ISP_RX  (via drill 0.1 pad 0.2 layers 1-2, 0.2)
  Top 0.152: U1.C7 v21,38 | R13.1 v33.4,40.13 32.89,40.13 32.51,39.75 TP24.TP
  Top 0.203: R21.2 R13.1
  Route2 0.152: v21,38 21.28,37.72 21.28,36.9 23.31,34.87 23.91,34.87 24.02,34.99 29.17,34.99 31.5,37.31 31.5,37.62 32.89,39.01 32.89,39.77 33.25,40.13 v33.4,40.13
ISP_SWCLK  (via drill 0.2)
  Top 0.152: U7.30 27.18,42.04 26.98,42.24 v26.98,42.42
  Bottom 0.152: TP1.TP 28.19,41.91 27.86,42.24 27.15,42.24 v26.98,42.42
ISP_SWDIO  (via drill 0.2)
  Top 0.152: U7.28 27.67,42.69 v27.56,42.8
  Bottom 0.152: v27.56,42.8 27.56,43.18 28.19,43.81 TP2.TP
ISP_TX  (via drill 0.1 pad 0.2 layers 1-2, 0.2)
  Top 0.152: U1.C6 v21.5,38 | R12.1 v36.45,40.89 | 36.84,41.53 | 36.84,41.53 36.84,42.4 TP27.TP | R20.2 37.08,41.29 36.84,41.53
  Top 0.203: R12.1 36.84,41.53
  Route2 0.152: v21.5,38 21.55,37.95 21.55,36.99 23.41,35.13 23.8,35.13 23.91,35.24 28.93,35.24 31.24,37.55 31.24,37.85 32.51,39.12 32.51,40.01 33.5,41 35.74,41 35.84,40.89 v36.45,40.89
LED_B  (via drill 0.1 layers 1-2, 0.2)
  Top 0.152: U1.A2 23.25,37.08 23.37,36.96 23.62,36.96 v23.88,36.7
  Route2 0.203: v30.61,39.37 30.35,39.12 30.35,38.29 28.33,36.27 24.43,36.27 24.06,36.63 23.95,36.63 v23.88,36.7
  Bottom 0.203: v30.61,39.37 30.86,39.62 30.86,42.04 33.15,44.32 35.8,44.32 36.26,43.87 36.64,43.87 37.1,44.32 39.38,44.32 R26.2
LED_G  (via drill 0.1 layers 1-2, 0.2)
  Top 0.152: U1.A3 22.75,37.12 23.24,36.64 23.49,36.64 v23.75,36.38
  Route2 0.203: v31.29,39.32 30.66,38.69 30.66,38.09 28.47,35.9 24.36,35.9 23.94,36.32 23.81,36.32 v23.75,36.38
  Bottom 0.203: v31.29,39.32 31.32,39.35 31.32,39.94 31.24,40.02 31.24,41.91 33.27,43.94 35.75,43.94 36.13,43.56 36.77,43.56 37.15,43.94 38.1,43.94 38.86,43.18 R25.2
LED_R  (via drill 0.1 layers 1-2, 0.2)
  Top 0.152: v23.42,36.27 23.1,36.27 22.25,37.12 U1.A4
  Route2 0.203: v31.75,40.34 v31.75,40.33 31.75,38.88 30.96,38.09 30.96,37.86 28.66,35.56 24.27,35.56 23.81,36.02 23.68,36.02 v23.42,36.27
  Bottom 0.203: v31.75,40.34 31.75,41.91 33.4,43.56 35.7,43.56 36.01,43.26 36.89,43.26 37.2,43.56 37.59,43.56 38.86,42.29 R24.2
LSM_IRQ1  (via drill 0.2 pad 0.2)
  Top 0.152: U1.E8 20.22,39.28 18.24,39.28 17.4,40.13 17.4,45.21 v17.65,45.47 | v22.48,48.51 22.47,48.5 U10.4
  Bottom 0.152: v17.65,45.47 18.09,45.9 18.47,45.9 18.64,45.72 19.43,45.72 20.57,46.86 20.57,47.37 21.21,48.01 21.97,48.01 v22.48,48.51
LSM_IRQ2
  Top 0.152: U1.D8 19.77,38.75 19.52,39 18.17,39 16.97,40.2 16.97,47.45 17.53,48.01 U10.9
N$1
  Top 0.152: U2.C2 39.5,31.12 C1.1
N$2
  Top 0.152: U2.A1 39.92,29.72 40.34,29.29 40.85,29.29 R2.2
N$3
  Top 0.203: U8.P$J8 46.01,35.46 45.39,34.84 Y1.1 45.02,34.84
N$4
  pour Top (no thermals): 42.82,26.91 43.39,26.91 43.76,27.28 44.09,27.28 44.09,26.49 42.82,26.49
N$5
  Top 0.152: U3.3 42.16,26.79 42.52,27.16 43.03,27.16 43.23,27.35 Q1.2
N$6
  Top 0.152: U3.2 41.66,25.95 41.85,25.76 44.05,25.76 44.7,26.42 44.7,26.82 Q2.2
N$7
  Top 0.203: U8.P$J7 45.74,35.96 45.34,35.56 44.99,35.56 44.9,35.47 44.78,35.58 44.75,35.55 44.72,35.57 Y1.2
N$8
  Top 0.305: R4.1 C3.1 42.13,28.47 41.66,28 U3.5
N$9  (via drill 0.2 pad 0.25)
  Top 0.152: R9.2 23.57,42.98 v23.5,43.05 | v20.83,13.21 17.77,13.21 U11.13
  Bottom 0.152: v23.5,43.05 22.86,43.69 22.86,43.71 22.75,43.81 20.66,43.81 19.81,42.97 19.81,42.59 18.98,41.75 18.98,41.52 18.47,41.01 18.47,40.21 20.78,37.9 20.78,33.24 20.83,33.19 20.83,31.86 21.39,31.29 21.39,29.15 20.83,28.59 20.83,16.22 21,16.05 21,15.7 20.75,15.44 20.75,13.29 v20.83,13.21 22.23,11.81 TP6.TP
N$10  (via drill 0.2, 0.2 pad 0.25)
  Top 0.152: v18.8,43.05 18.67,43.18 R8.2 | U11.12 v19.81,14.22 20.32,14.22 21.21,15.11 v21.59,15.11
  Bottom 0.152: v18.8,43.05 18.41,43.05 18.16,42.8 18.16,41.78 17.7,41.33 17.7,39.89 19.99,37.61 19.99,16.27 19.76,16.04 19.76,15.19 19.81,15.14 v19.81,14.22 | TP5.TP 22.23,14.86 21.97,15.11 v21.59,15.11
N$11  (via drill 0.2, 0.2 pad 0.25)
  Top 0.152: v20.19,15.37 17.73,15.37 U11.11 | v24.64,44.32 R7.2
  Bottom 0.152: v20.19,15.37 20.19,15.64 20.14,15.7 20.14,16.05 20.32,16.24 20.32,28.8 20.89,29.36 20.89,31.03 20.26,31.66 20.26,37.69 17.96,40 17.96,41.22 18.41,41.68 18.41,41.91 19.3,42.8 19.3,43.18 20.47,44.34 24.62,44.34 v24.64,44.32
N$12  (via drill 0.2 pad 0.25)
  Top 0.152: R6.2 v23.5,43.69 | v20.57,15.88 20.02,16.42 U11.10
  Bottom 0.152: v23.5,43.69 23.24,43.69 22.86,44.07 20.55,44.07 19.56,43.08 19.56,42.69 18.67,41.8 18.67,41.57 18.21,41.11 18.21,40.1 20.52,37.79 20.52,33.14 20.57,33.09 20.57,31.75 21.14,31.18 21.14,29.26 20.57,28.69 v20.57,15.88
N$13
  Top 0.203: D1.1 R5.1
N$14
  Top 0.203: Y2.1 42.81,29.35 43.31,29.85 R5.2 46.48,30.1 47.19,30.81 47.19,32.32 46.63,32.88 U8.P$H9
N$15
  Top 0.203: U7.2 R12.2
N$16  (via drill 0.2)
  Top 0.203: U12.6 C15.1 | C15.1 | U11.38 30.31,9.82 v30.23,9.91 | v30.61,31.11 30.73,31.24 C15.1
  Bottom 0.203: v30.23,9.91 29.21,10.92 29.21,11.56 31.11,13.46 31.11,30.61 v30.61,31.11
N$17  (via drill 0.2)
  Top 0.203: U12.7 C16.1 | C16.1 | U11.40 31.09,11.52 30.75,11.52 30.61,11.38 30.04,11.38 30.02,11.37 v29.72,11.37 | v31.42,30.99 32,31.57 C16.1
  Bottom 0.203: v29.72,11.37 29.72,11.56 31.5,13.34 31.5,30.91 v31.42,30.99
N$18
  Top 0.32: U11.56 27.94,28.58 arc90 26.42,30.1 J2.IN
N$19  (via drill 0.2)
  Top 0.203: U12.3 C14.1 31.36,38.1 33.4,38.1 v33.66,38.35 | U11.39 v30.23,10.92
  Route2 0.203: v33.78,35.43 33.78,38.23 v33.66,38.35
  Bottom 0.203: v30.23,10.92 30.23,11.56 31.99,13.32 31.99,23.24 32,23.25 32,23.3 32,29.97 32.89,30.86 32.89,34.54 v33.78,35.43
N$20  (via drill 0.2)
  Top 0.152: R10.1 v47.12,42.93 | v23.75,1.14 24.13,1.14 24.64,1.65 U11.27
  Route2 0.152: v43.31,34.8 42.8,34.8 42.42,35.18 42.42,35.45 41.8,36.07 38.09,36.07 36.07,34.05 36.07,33.22 35.31,32.46 33.9,32.46 33.72,32.64 24.9,32.64 24.85,32.59 22.36,32.59 22.06,32.89 21.8,32.89 21.75,32.84 19.1,32.84 v18.56,33.38
  Bottom 0.152: v47.12,42.93 45.47,42.93 43.56,41.02 43.56,35.92 43.74,35.74 43.74,35.23 v43.31,34.8 | v18.56,33.38 18.56,33.15 19.18,32.54 19.18,31.7 18.62,31.14 18.62,29.84 18.61,29.83 18.61,29.26 19.01,28.86 19.02,28.86 19.18,28.7 19.18,16.53 18.16,15.52 18.16,4.59 19.2,3.56 22.88,3.56 23.5,2.94 23.5,1.4 v23.75,1.14 24.13,1.14 24.51,1.52 24.51,2.79 23.24,4.06 22.48,4.06 22.23,4.32 TP7.TP
N$21  (via drill 0.2)
  Top 0.152: R11.1 v46.86,43.69 | U11.26 23.54,2.24 v24,1.78
  Route2 0.152: v43.31,35.56 42.67,35.56 41.91,36.32 37.98,36.32 35.81,34.15 35.81,33.32 35.21,32.72 34.01,32.72 33.83,32.89 24.8,32.89 24.75,32.84 22.47,32.84 22.16,33.15 21.69,33.15 21.64,33.1 19.61,33.1 v19.3,33.4
  Bottom 0.152: v46.86,43.69 46.48,43.31 45.34,43.31 43.18,41.15 43.18,35.69 v43.31,35.56 | v19.3,33.4 19.3,33.15 19.43,33.02 19.43,31.47 18.87,30.91 18.87,29.74 18.86,29.72 18.86,29.37 19.11,29.11 19.12,29.11 19.43,28.81 19.43,16.43 19.13,16.12 19.13,11.89 18.41,11.18 18.41,6.22 | 18.41,6.22 18.41,4.7 19.3,3.81 22.99,3.81 24,2.79 v24,1.78 | TP9.TP 18.54,6.35 18.41,6.22
N$22
  Top 0.203: U7.48 R13.2
N$23
  Top 0.203: U8.P$J5 R16.1
N$24
  Top 0.203: U8.P$J4 45.73,37.46 45.59,37.59 R17.1
N$25  (1 unrouted)
N$25_N
  Top 0.203: R18.2 19.56,38.35 19.68,38.23 20.23,38.23 U1.C8
N$25_P
  Top 0.203: U1.B8 20.22,37.72 19.68,37.72 19.56,37.59 R19.2
N$27
  Top 0.152: U1.B1 24.23,37.75 24.64,37.34 25.88,37.34 Y3.1 26.51,37.37 26.67,37.21 C36.1
N$28
  Top 0.152: U1.A1 24.3,37.25 24.51,37.03 24.82,37.03 25.3,36.54 Y3.2 26.51,36.54 26.67,36.7 C37.1
N$29
  Top 0.152: U1.C1 23.77,38.25 23.86,38.34 23.86,38.41 24.12,38.66 24.96,38.66 C39.1 25.86,38.6 Y4.3
N$30
  Top 0.152: Y4.1 27.31,39.55 C38.1 27.18,40.13 25.4,40.13 25.27,40.01 25.27,39.37 24.89,38.99 24.09,38.99 23.85,38.75 U1.D1
N$31
  Top 0.305: U8.P$A4 52.52,37.46 ANT1.8
N$32
  Top 0.203: U11.28 25.74,2.84 26.16,2.41 26.16,1.91 26.67,1.4 27.94,1.4 R22.2
N$33
  Top 0.203: U11.29 26.84,2.71 26.54,2.41 26.54,2.03 26.8,1.78 28.45,1.78 R23.2
N$34  (via drill 0.1 pad 0.2 layers 1-2)
  Top 0.152: U1.B4 22.24,37.75 v21.99,37.5 | v22.27,36.7 22.27,36.66 22.61,36.32 R1.1
  Route2 0.152: v22.27,36.7 22,36.97 22,37.49 v21.99,37.5
N$35
  Bottom 0.203: R24.1 41.02,42.29 41.4,42.67 41.4,42.93 41.71,43.23 D2.B4
N$36
  Bottom 0.203: R25.1 40.64,43.18 42.19,44.73 D2.B3
N$37
  Bottom 0.203: R26.1 40.89,44.2 41.53,44.83 41.53,45.21 41.91,45.59 43.31,45.59 43.55,45.35 D2.B2
N$38  (via drill 0.2)
  Top 0.203: C48.2 41.66,34.15 41.27,33.77 v41.27,33.53
  Bottom 0.203: v41.27,33.53 40.13,33.53 39.37,32.77 39.37,31.88 38.99,31.5 38.99,29.97 37.34,28.32 J1.P24
N$39  (via drill 0.2)
  Top 0.203: C47.2 38.91,34.07 v38.91,33.45
  Route2 0.203: v38.91,33.45 38.57,33.45 38.54,33.48 38.16,33.48 35.69,31 v35.63,31
  Bottom 0.203: J1.P22 36.08,29.33 35.94,29.46 35.94,30.68 v35.63,31
N$40  (via drill 0.2)
  Top 0.203: C43.2 34.67,33.66 v34.92,33.4
  Bottom 0.203: v34.92,33.4 34.92,32.38 35.98,31.33 J1.P18
N$41  (via drill 0.2)
  Top 0.203: C49.2 35.94,33.91 36.75,33.1 37.55,33.1 37.85,32.8 v37.85,32.51
  Bottom 0.203: v37.85,32.51 37.85,30.73 37.44,30.33 J1.P20
N$42  (via drill 0.2)
  Top 0.203: v38.35,33.02 38.18,33.02 37.59,33.61 C45.1 37.23,34.15 36.78,34.59 36.78,36.01 D3.1
  Bottom 0.203: J1.P21 37.7,29.83 38.23,30.35 38.23,31.66 38.35,31.79 v38.35,33.02
N$43  (via drill 0.2)
  Top 0.203: C46.1 40.39,34.04 | 40.39,34.04 39.62,33.27 39.5,33.27 v38.86,32.64 | D4.2 41.27,36.07 41.27,34.49 40.82,34.04 40.39,34.04
  Bottom 0.203: J1.P23 37.21,28.83 38.61,30.23 38.61,31.61 38.81,31.82 38.81,32.59 v38.86,32.64
N$44  (via drill 0.2)
  Top 0.203: Q3.1 36.53,38.66 36.32,38.86
  Top 0.305: 36.32,38.86 v35.81,38.86 35.69,38.73 R27.2
  Bottom 0.305: J1.P3 35.85,38.83 v35.81,38.86
N$45  (via drill 0.2)
  Top 0.203: Q3.2 36.88,39.07 36.45,39.5 v35.81,39.5
  Bottom 0.203: J1.P2 35.98,39.33 v35.81,39.5
N$46  (via drill 0.2)
  Top 0.203: R28.1 41.91,46.86 v41.53,47.24
  Bottom 0.203: D6.B4 41.54,47.23 v41.53,47.24
N$47
  Top 0.203: C50.2 40.27,36.83 D4.1 41.4,36.83 41.53,36.7 D5.2
N$48
  Top 0.305: Q3.3 37.52,37.77 L1.2 38.72,37.98 C50.1 37.34,36.58 37.21,36.7 D3.2
N$49  (via drill 0.2)
  Top 0.203: R29.1 v41.66,48.77
  Bottom 0.203: D6.B3 41.69,48.73 v41.66,48.77
N$50  (via drill 0.2)
  Top 0.203: R30.1 44.58,47.75 v44.32,48.01
  Bottom 0.203: D6.B2 43.6,48.73 v44.32,48.01
N$51  (via drill 0.1 layers 1-2, 0.2)
  Top 0.203: U7.6 36.16,43.34 v36.32,43.18 | R30.2 46.86,47.75 47.37,47.24 v47.37,45.85
  Route2 0.203: v36.32,43.18 38.35,43.18 39.19,42.34 40.89,42.34 41.91,41.33 43.61,41.33 45.34,43.05 45.34,44.83 46.35,45.85 v47.37,45.85
N$52  (via drill 0.1 layers 1-2, 0.2)
  Top 0.203: U7.34 29.99,40.75 v30.23,40.51 | v47.24,44.7 47.88,45.34 47.88,48.13 47.24,48.77 R29.2
  Route2 0.203: v47.24,44.7 46.61,44.7 46.23,44.32 46.23,42.93 43.76,40.46 41.72,40.46 40.7,41.48 38.61,41.48 38.3,41.78 32.26,41.78 32.23,41.76 31.86,41.76 30.71,40.62 30.61,40.51 v30.23,40.51
N$53  (via drill 0.1 layers 1-2, 0.2)
  Top 0.203: U7.9 34.22,43.38 v34.29,43.31 | v46.61,45.21 46.61,46.35 R28.2
  Route2 0.203: v34.29,43.31 35.43,43.31 35.99,42.75 38.15,42.75 38.99,41.91 40.77,41.91 41.78,40.89 43.69,40.89 45.85,43.05 45.85,44.58 46.48,45.21 v46.61,45.21
N$54
  Top 0.152: 21.32,30.1 C51.1 | 22.99,30.08 J2.OUT
  Top 0.32: J2.OUT 21.46,30.1 21.35,30.1 | 21.35,30.1 arc90 C51.1 | L2.1 20.23,30.1 20.23,30.09 20.66,30.09 20.67,30.1 21.35,30.1
N$55
  Top 0.152: C52.1
  Top 0.32: L2.2 arc-90 19.52,30.08 C52.1 U$1.1 arc-90 U$1.1
N$56  (via drill 0.2)
  other vias: 24.13,21.21
N$57
  Top 0.203: R32.2 78.75,32.73 | 78.75,32.73 R31.1 | S1.P$4 79.75,44.51 79.39,44.15 79.39,43.58 78.36,42.55 77.85,42.55 77.34,42.04 77.34,33.78 77.09,33.53 77.09,32.51 78.11,31.5 78.49,31.5 78.75,31.76 78.75,32.73
N$58  (via drill 0.2)
  Top 0.152: U11.17 18.21,9.24 18.51,9.24 19.94,10.67 v19.94,10.92
  Bottom 0.152: TP13.TP 19.43,10.41 v19.94,10.92
PACK+  (via drill 0.2)
  Route2 0.508: v17.14,3.3 17.14,7.11 24.83,14.8 24.83,20.99 24.77,21.05 v24.77,21.59
  Bottom 0.508: J3.P$1 18,2.45 v17.14,3.3
  other vias: 39.88,28.7 39.88,28.19 40.39,27.94 40.39,28.45
  pour Route2: 23.5,19.81 28.45,19.81 28.45,23.24 32.77,27.56 41.4,27.56 42.29,28.45 42.29,30.1 32,30.1 23.5,21.59
  pour Bottom (no thermals): 23.62,19.81 23.62,22.23 28.45,22.23 28.45,19.81
  pour Top (no thermals): 39.44,28 39.44,26.63 41.03,26.63 41.22,26.82 41.22,28.24 40.51,28.96 40.13,28.96 39.58,29.51 39.58,29.78 39.42,29.78 39.42,29.51 39.24,29.34 39.24,28.19
QSPI_CS  (via drill 0.1 pad 0.2 layers 1-2)
  Top 0.152: U1.H7 v20.5,41 | U13.B4 20.26,44.06 20.2,44 20.12,44 v20.07,43.94
  Route2 0.152: v20.5,41 20.5,41.6 19.56,42.55 19.56,43.31 20.07,43.81 v20.07,43.94
QSPI_IO0  (via drill 0.1 pad 0.2 layers 1-2)
  Top 0.152: U1.G6 v21,40.5 | U13.E3 21.96,43.31 21.72,43.08 v21.72,43.05
  Route2 0.152: v21,40.5 21.16,40.66 21.16,41.86 21.72,42.42 v21.72,43.05
QSPI_IO1  (via drill 0.1 pad 0.2 layers 1-2)
  Top 0.152: U1.G5 v21.5,40.5 | v21.21,43.81 U13.C4
  Route2 0.152: v21.5,40.5 21.5,41.82 22.05,42.37 22.05,43.23 21.46,43.81 v21.21,43.81
QSPI_IO2  (via drill 0.1 pad 0.2 layers 1-2)
  Top 0.152: U1.H4 22.12,40.88 v22.12,41.25 | v21.46,44.32 U13.D4
  Route2 0.152: v22.12,41.25 22.12,41.5 22.3,41.68 22.3,43.36 21.46,44.2 v21.46,44.32
QSPI_IO3  (via drill 0.1 pad 0.2 layers 1-2)
  Top 0.152: v20.7,43.81 v20.71,43.81 U13.C3 | U1.G4 v22,40.5
  Route2 0.152: v20.7,43.81 20.7,44.32 21.01,44.63 21.58,44.63 21.78,44.43 21.78,44.24 22.55,43.46 22.55,41.5 | 22.55,41.5 | v22,40.5 22,40.63 22.48,41.11 22.48,41.43 22.55,41.5
QSPI_SCK  (via drill 0.1 pad 0.2 layers 1-2)
  Top 0.152: U1.G7 v20.5,40.5 | U13.D3 21.46,43.31 21.21,43.07 v21.21,43.05
  Route2 0.152: v20.5,40.5 20.83,40.83 20.83,41.91 21.21,42.3 v21.21,43.05
SARA_CTS  (via drill 0.1 pad 0.2 layers 1-2)
  Top 0.152: v23.93,41.32 25.15,42.54 25.15,43.1 25.72,43.68 R7.1 | U1.G2 23.26,40.25 v23.51,40.5
  Route2 0.152: v23.93,41.32 23.51,40.91 v23.51,40.5
SARA_D_N  (via drill 0.2)
  Top 0.203: R22.1 v29.34,1.27
  Bottom 0.203: TP4.TP v29.34,1.27
SARA_D_P  (via drill 0.2)
  Top 0.203: R23.1 29.34,1.91 v29.59,2.16
  Bottom 0.203: v29.59,2.16 30.48,3.05 TP10.TP
SARA_POWER  (via drill 0.1 pad 0.2 layers 1-2, 0.2 pad 0.25)
  Top 0.152: U1.F2 v23.5,40 | v19.05,10.92 U11.15
  Route2 0.076: 23.25,40.26 23.24,40.26
  Route2 0.102: 23.25,40.76 23.24,40.77
  Route2 0.127: 23.24,40.35 23.24,40.75 23.25,40.76
  Route2 0.152: v23.5,40 23.24,40.26 23.24,40.35 | v18.41,44.58 18.8,44.96 19.33,44.96 19.63,45.26 21.79,45.26 22.42,44.64 22.42,44.32 23.06,43.67 23.06,42.24 23.52,41.78 23.52,41.3 23.24,41.02 23.24,40.77
  Bottom 0.152: v18.41,44.58 18.41,43.43 17.91,42.93 17.91,41.89 17.45,41.43 17.45,39.79 19.74,37.5 19.74,16.37 19.38,16.02 19.38,11.25 v19.05,10.92
SARA_RTS
  Top 0.152: R6.1 24.64,43.69 24.89,43.43 24.89,42.72 23.25,41.08 U1.H2
SARA_RX  (via drill 0.1 pad 0.2 layers 1-2)
  Top 0.152: R9.1 24.51,42.77 v23.24,41.5 | U1.G3 22.75,40.28 22.94,40.46 v22.96,40.46
  Route2 0.152: v23.24,41.5 23.09,41.35 23.09,41.28 22.99,41.18 22.99,40.77 22.96,40.74 v22.96,40.46
SARA_TX  (via drill 0.1 pad 0.2 layers 1-2)
  Top 0.152: v23,40 U1.F3 | R8.1 18.92,44.32 v18.92,44.58
  Route2 0.152: v18.92,44.58 19.43,44.58 19.8,44.95 21.69,44.95 22.1,44.53 22.1,44.28 22.81,43.57 22.81,41.65 22.83,41.62 22.83,41.39 22.73,41.29 22.73,41 22.5,40.76 22.5,40.5 v23,40
SCL  (via drill 0.1 layers 1-2, 0.2)
  Top 0.152: U1.G8 20.06,40.25 19.69,39.88 18.41,39.88 17.91,40.38 17.91,44.68 18.26,45.03 18.47,45.03 18.77,45.34 19.43,45.34 20.07,45.97 | 20.07,45.97 U10.13 20.07,47.5 v19.94,47.62 | 20.07,45.97 20.45,45.59 21.08,45.59 21.18,45.7 v21.46,45.7 | R15.2 21.77,45.85 21.61,45.7 v21.46,45.7 | v21.46,45.7 21.46,45.57 21.65,45.38 22.09,45.38 22.77,44.7 22.77,44.41 22.92,44.26 v24,44.26 | U2.B1 40.39,30.1 v40.77,30.48
  Route2 0.152: v42.8,41.91 42.8,43.43 42.04,44.2 36.93,44.2 36.63,43.89 36.27,43.89 35.97,44.2 29.34,44.2 28.95,43.81 24.45,43.81 v24,44.26
  Bottom 0.152: v40.77,30.48 40.89,30.61 40.89,31.24 42.8,33.15 v42.8,41.91 | TP21.TP 19.68,47.62 v19.94,47.62
SDA  (via drill 0.2, 0.2 pad 0.2)
  Top 0.152: U1.F8 20.07,39.58 18.33,39.58 17.65,40.26 17.65,44.83 v18.29,45.47 | U10.14 v20.57,46.11 v20.57,46.1 21.08,46.1 21.46,46.48 R14.2 | U2.C1 40.15,30.5 40.34,30.68 v40.34,31.16
  Route2 0.152: v20.57,46.1 21.08,46.1 21.21,46.23 21.72,46.23 22.1,45.85 22.1,45.31 22.67,44.74 22.67,44.51 23.06,44.12 23.67,44.12 24.36,43.43 29.08,43.43 29.46,43.81 35.99,43.81 36.16,43.64 36.73,43.64 36.91,43.81 41.78,43.81 42.16,43.43 v42.16,42.16
  Bottom 0.152: v18.29,45.47 19.94,45.47 v20.57,46.1 21.08,46.1 21.59,46.61 TP22.TP | v40.34,31.16 42.42,33.25 42.42,41.02 42.16,41.27 v42.16,42.16
ST_SWCLK  (via drill 0.2)
  Top 0.152: U1.A7 20.75,35.61 19.56,34.42 v18.92,34.42
  Bottom 0.152: v18.92,34.42 18.54,34.42 17.78,33.66 TP18.TP
ST_SWDIO  (via drill 0.2 pad 0.2)
  Top 0.152: U1.A8 20.25,36 19.3,35.05 v19.18,35.05
  Bottom 0.152: TP17.TP 17.4,27.94 16.76,28.57 16.76,33.15 18.67,35.05 v19.18,35.05
ST_SWO  (via drill 0.2)
  Top 0.203: U1.A5 21.75,35.77 22.31,35.22 22.44,35.22 22.48,35.18 23.24,35.18 v23.62,35.56
  Bottom 0.203: TP11.TP 23.5,35.56 v23.62,35.56
SWITCH1  (via drill 0.1 layers 1-2, 0.2)
  Top 0.152: U1.H8 v20,41 | v45.59,34.29 45.59,31.37 v45.97,30.99
  Top 0.203: R32.1 | v77.72,33.27 77.88,33.43 R32.1 | R32.1 78.22,33.44 C53.1
  Route2 0.152: v20,41 19.91,41 18.64,41 18.16,40.51 18.16,37.21 19.05,36.32 20.07,36.32 22.78,33.6 24.43,33.6 24.48,33.66 34.21,33.66 34.64,34.09 34.67,34.09 37.67,37.08 43.57,37.08 43.59,37.1 45.19,37.1 45.71,36.58 45.71,34.65 45.59,34.53 v45.59,34.29
  Route2 0.203: v45.97,30.99 v45.98,30.99
  Route2 0.254: v77.72,33.27 67.06,33.27 64.52,30.73 46.24,30.73 v45.98,30.99
TIMEPULSE  (via drill 0.1 layers 1-2, 0.2)
  Top 0.152: U8.P$C3 49.33,37.96 v49.55,37.74
  Route2 0.152: v49.55,37.74 49.55,36.21 48.51,35.18 47.26,35.18 45.23,33.15 v44.83,33.15
  Bottom 0.152: TP8.TP 47.24,32.51 45.42,32.51 44.83,33.1 v44.83,33.15
USB_D_N  (via drill 0.2)
  Top 0.203: R18.1 18.29,37.97 18.24,37.92 17.77,37.92 17.44,37.59 v16.51,37.59
  Bottom 0.203: TP19.TP 16.64,37.59 v16.51,37.59
USB_D_P  (via drill 0.2)
  Top 0.203: R19.1 17.91,37.59 17.02,36.7 v17.02,36.32
  Bottom 0.203: TP20.TP 17.91,36.2 17.78,36.07 17.27,36.07 v17.02,36.32
VSIM  (via drill 0.2)
  Top 0.203: U12.8 C17.1 C18.1 33.15,30.99 v32.26,30.99 | U11.41 30.44,13.12 v30.23,13.34
  Bottom 0.203: v30.23,13.34 30.68,13.79 30.68,30.15 29.97,30.86 29.97,31.37 30.35,31.75 31.5,31.75 v32.26,30.99
ZOE_CLK
  Top 0.152: U8.P$2E1 48.13,39.37 48.37,39.61 48.99,39.61 49.1,39.72 49.1,40.08 49.41,40.39 U9.6
ZOE_CS  (via drill 0.1 layers 1-2)
  Top 0.152: U8.P$D3 v48.63,38.35 v48.64,38.35 | v48.26,40.64 48.26,41.15 48.01,41.4 47.33,41.4 U9.1
  Route2 0.152: v48.64,38.35 48.44,38.56 48.44,40.46 v48.26,40.64
ZOE_DIO0
  Top 0.152: U8.P$D1 48.63,39.22 48.77,39.36 49.1,39.36 49.35,39.61 49.35,39.7 49.54,39.89 U9.5
ZOE_DIO1  (via drill 0.1 layers 1-2)
  Top 0.152: U8.P$C1 49.13,38.62 v49.15,38.61 | v46.56,40.51 46.56,40.72 46.74,40.89 U9.2
  Route2 0.152: v49.15,38.61 49.15,38.35 48.77,37.97 47.37,37.97 47.12,38.23 47.12,38.48 47.5,38.86 47.5,39.88 46.86,40.51 v46.56,40.51
ZOE_DIO2  (via drill 0.1 layers 1-2)
  Top 0.152: U8.P$E3 v48.13,38.35 | v48.13,40.13 47.88,40.39 U9.3
  Route2 0.152: v48.13,38.35 v48.13,40.13
ZOE_DIO3  (via drill 0.1 layers 1-2)
  Top 0.152: U8.P$F3 47.63,38.35 v47.62,38.35 | v49.4,40.89 U9.7
  Route2 0.152: v47.62,38.35 47.83,38.56 47.83,40.77 48.01,40.95 49.27,40.95 49.33,40.89 v49.4,40.89

## Text on the board
bPlace: Cellular Asset Tracker | Version 5.0.0 | Design and Developed | Profero Technology, LLC